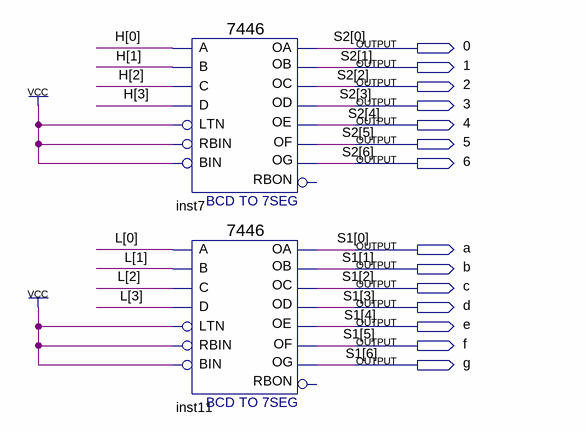
[diagram p0: schematic sheet]
// Quartus schematic 译码器.bdf as structural Verilog: 2 symbols, 14 pins
module \译码器  (
  output \0 ,
  output \1 ,
  output \2 ,
  output \3 ,
  output \4 ,
  output \5 ,
  output \6 ,
  output a,
  output b,
  output c,
  output d,
  output e,
  output f,
  output g
);

  wire [3:0] H, L;

  \7446  inst7 (
    .D(H[3]), .C(H[2]), .B(H[1]), .LTN(1'b1), .A(H[0]), .RBIN(1'b1), .BIN(1'b1), .OC(\2 ), .OD(\3 ),
    .OE(\4 ), .OA(\0 ), .OB(\1 ), .OF(\5 ), .OG(\6 ));  // open: RBON
  \7446  inst11 (
    .D(L[3]), .C(L[2]), .B(L[1]), .LTN(1'b1), .A(L[0]), .RBIN(1'b1), .BIN(1'b1), .OC(c), .OD(d), .OE(e),
    .OA(a), .OB(b), .OF(f), .OG(g));  // open: RBON

  // Other names for the same wires on the sheet: S1[6:0] = {g, f, e, d, c, b, a};
  //   S2[6:0] = {\6 , \5 , \4 , \3 , \2 , \1 , \0 }
endmodule
